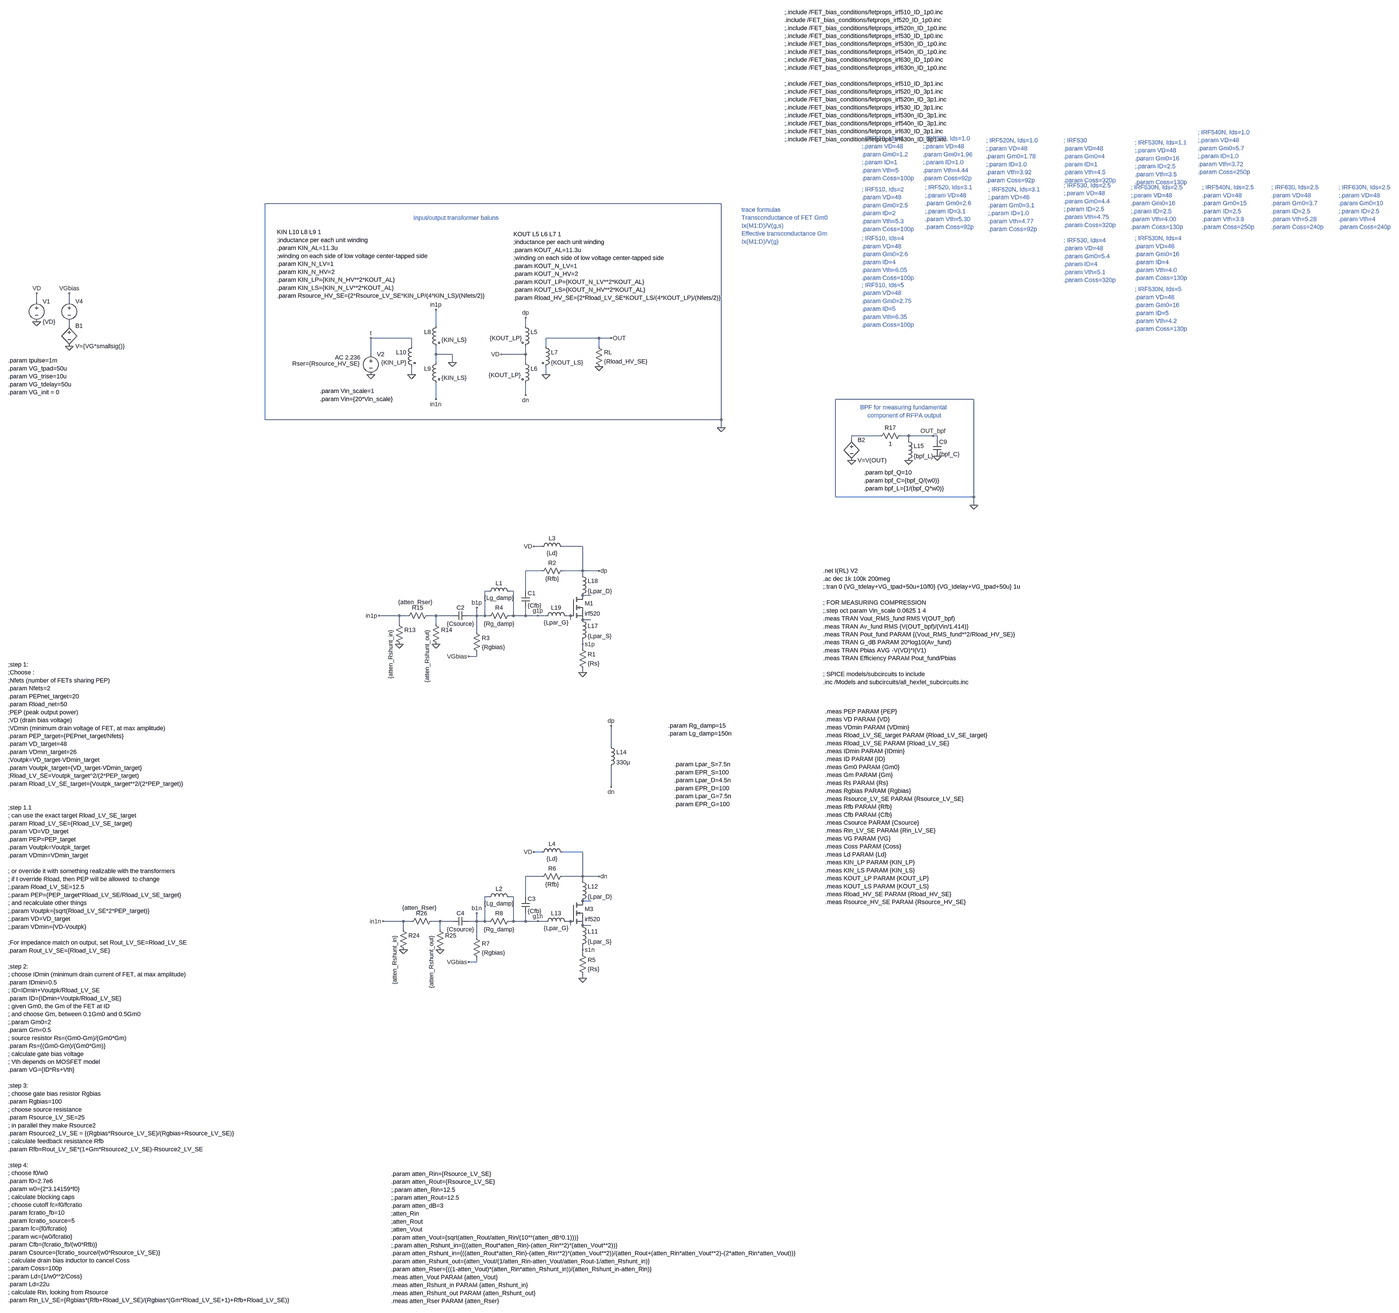
[diagram p0: schematic RFPA_IRF520_pushpull_tran_param.asc, whole sheet]
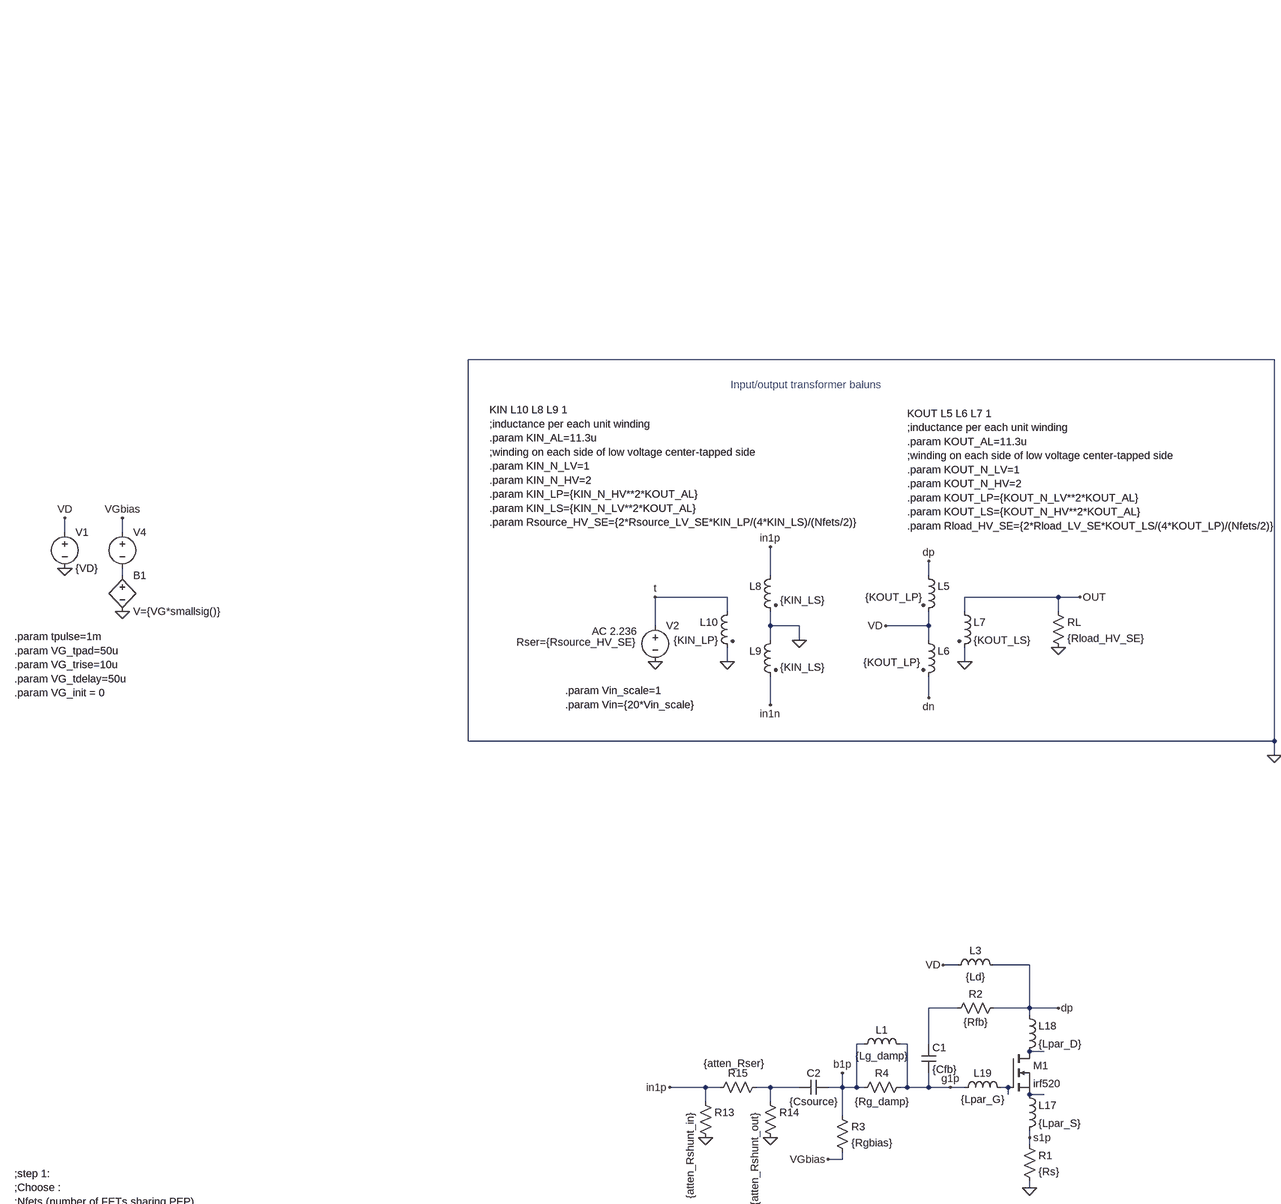
[diagram p1: schematic RFPA_IRF520_pushpull_tran_param.asc, part, row 1 of 2, column 1 of 2]
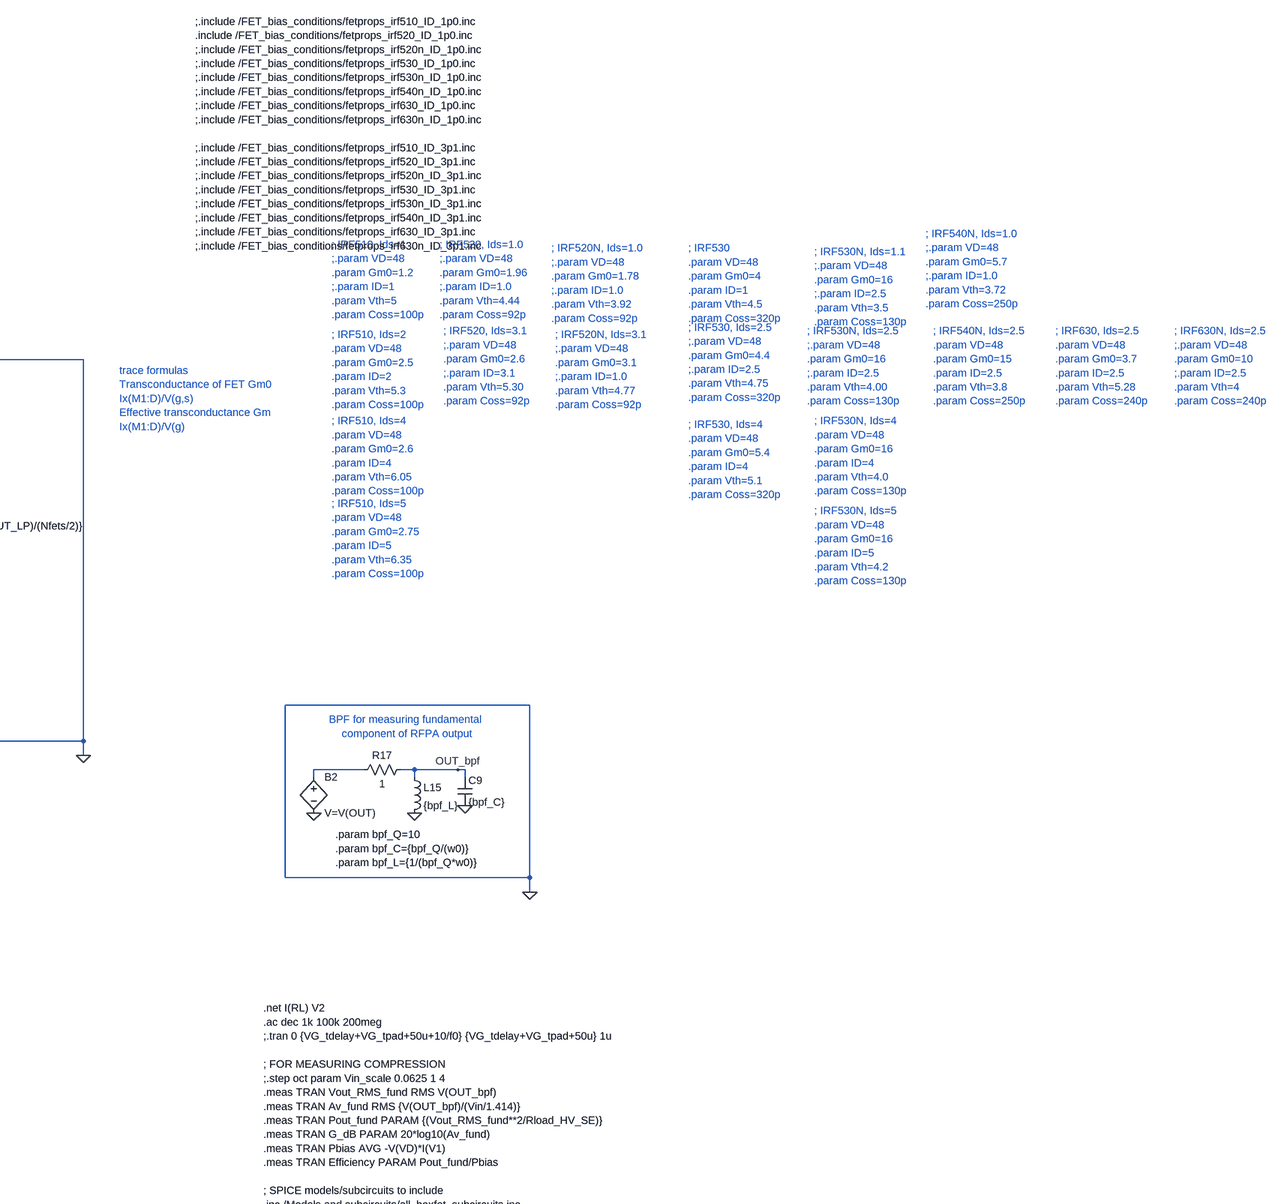
[diagram p2: schematic RFPA_IRF520_pushpull_tran_param.asc, part, row 1 of 2, column 2 of 2]
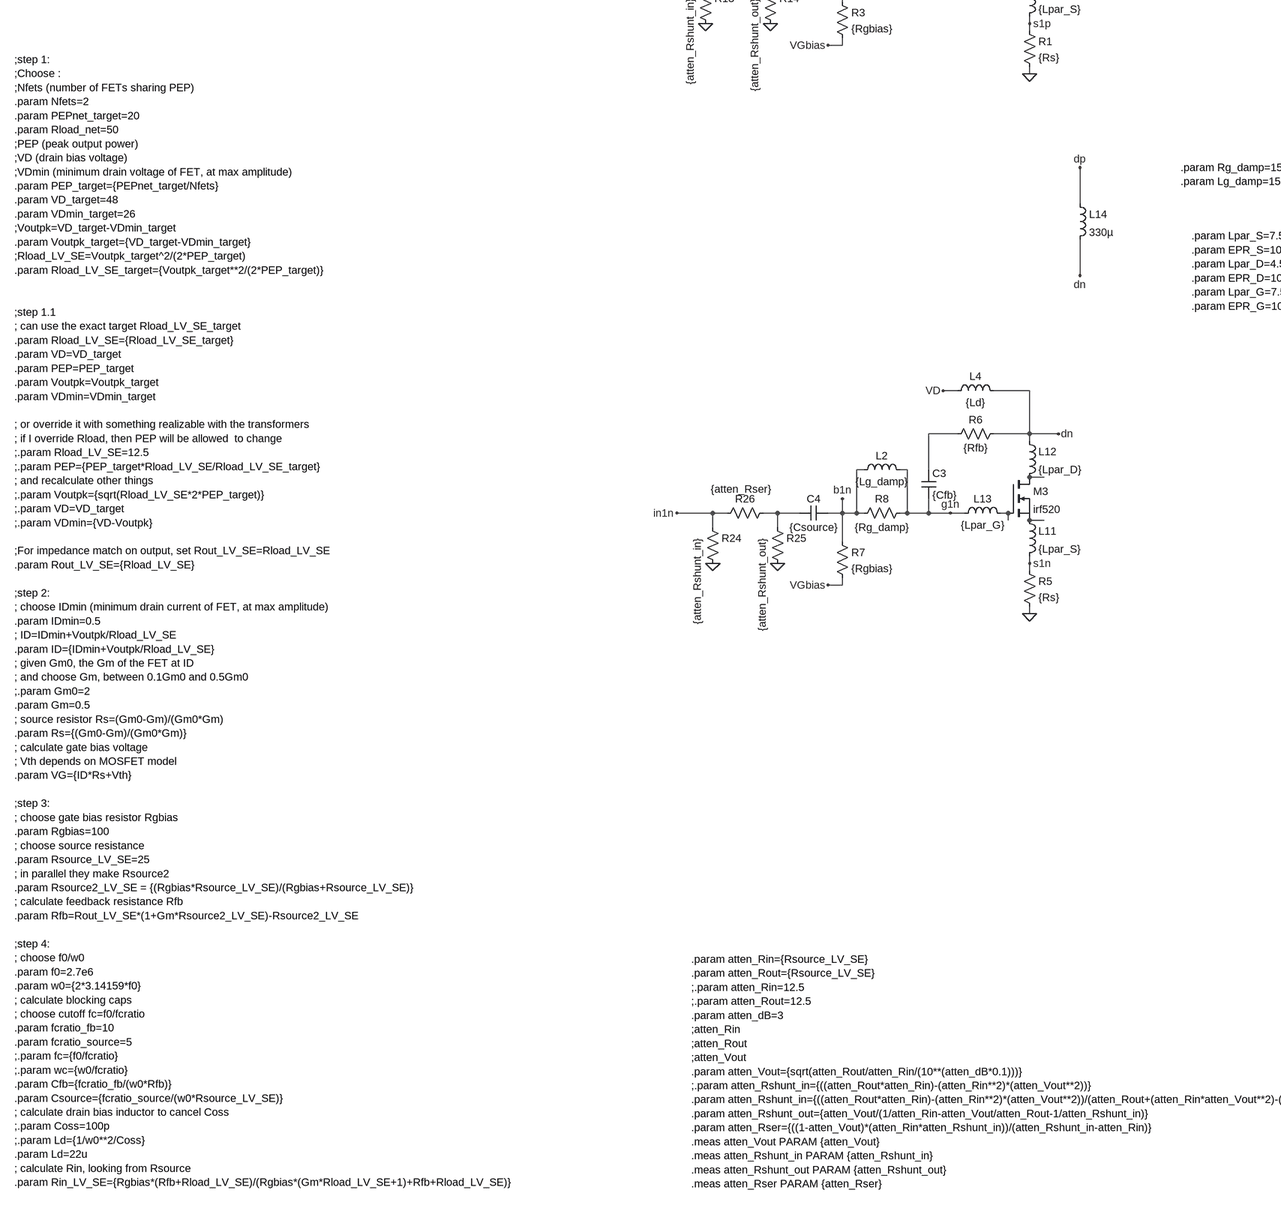
[diagram p3: schematic RFPA_IRF520_pushpull_tran_param.asc, part, row 2 of 2, column 1 of 2]
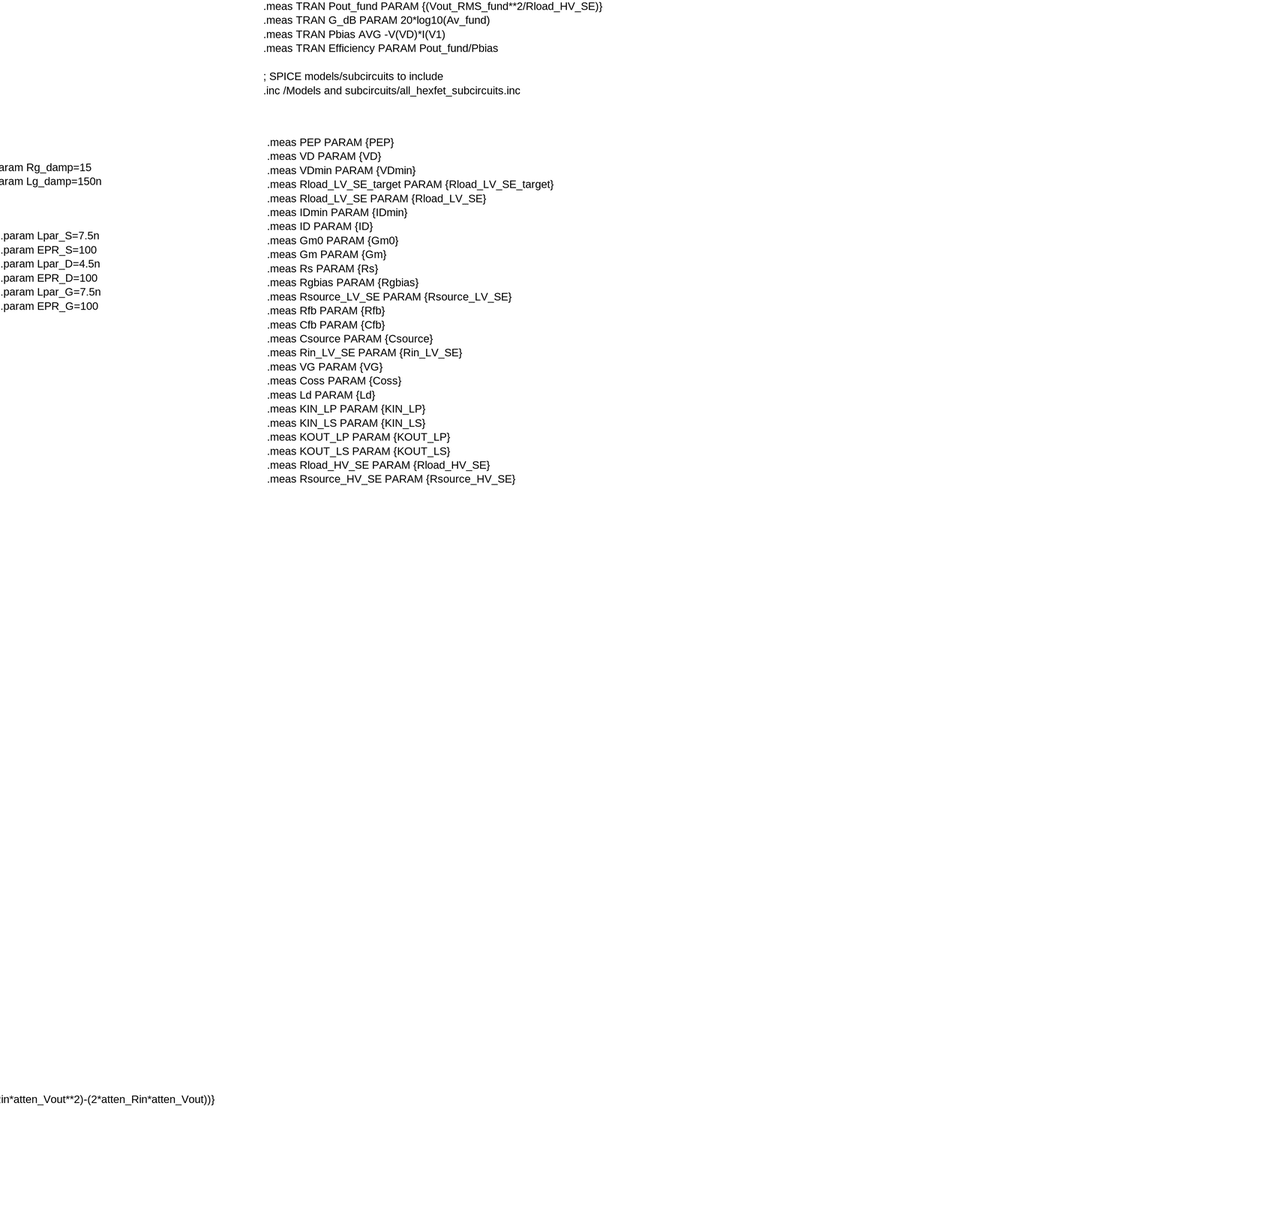
[diagram p4: schematic RFPA_IRF520_pushpull_tran_param.asc, part, row 2 of 2, column 2 of 2]
RFPA_IRF520_pushpull_tran_param.asc, the LTspice schematic file:
Version 4
SHEET 1 5344 3112
WIRE 560 -1712 -1232 -1712
WIRE -2128 -1328 -2128 -1360
WIRE -2000 -1328 -2000 -1360
WIRE -2000 -1232 -2000 -1248
WIRE -560 -1232 -560 -1296
WIRE -208 -1232 -208 -1264
WIRE -656 -1184 -816 -1184
WIRE 80 -1184 -128 -1184
WIRE 128 -1184 80 -1184
WIRE -656 -1152 -656 -1184
WIRE -128 -1152 -128 -1184
WIRE 80 -1152 80 -1184
WIRE -816 -1120 -816 -1184
WIRE -560 -1120 -560 -1152
WIRE -496 -1120 -560 -1120
WIRE -208 -1120 -208 -1152
WIRE -208 -1120 -304 -1120
WIRE -560 -1088 -560 -1120
WIRE -496 -1088 -496 -1120
WIRE -208 -1088 -208 -1120
WIRE -656 -1040 -656 -1072
WIRE -128 -1040 -128 -1072
WIRE -208 -960 -208 -1008
WIRE -560 -944 -560 -1008
WIRE 1552 -944 1008 -944
WIRE -1232 -864 -1232 -1712
WIRE 560 -864 560 -1712
WIRE 560 -864 -1232 -864
WIRE 560 -832 560 -864
WIRE 1184 -800 1072 -800
WIRE 1296 -800 1264 -800
WIRE 1392 -800 1296 -800
WIRE 1408 -800 1392 -800
WIRE 1072 -784 1072 -800
WIRE 1296 -784 1296 -800
WIRE 1408 -784 1408 -800
WIRE 1008 -560 1008 -944
WIRE 1552 -560 1552 -944
WIRE 1552 -560 1008 -560
WIRE 1552 -528 1552 -560
WIRE -144 -336 -176 -336
WIRE 16 -336 -64 -336
WIRE -144 -240 -208 -240
WIRE 16 -240 16 -336
WIRE 16 -240 -64 -240
WIRE 80 -240 16 -240
WIRE 16 -224 16 -240
WIRE -352 -160 -368 -160
WIRE -256 -160 -272 -160
WIRE -208 -160 -208 -240
WIRE 48 -144 16 -144
WIRE -704 -64 -784 -64
WIRE -672 -64 -704 -64
WIRE -560 -64 -592 -64
WIRE -496 -64 -560 -64
WIRE -400 -64 -400 -96
WIRE -400 -64 -432 -64
WIRE -368 -64 -368 -160
WIRE -368 -64 -400 -64
WIRE -352 -64 -368 -64
WIRE -256 -64 -256 -160
WIRE -256 -64 -272 -64
WIRE -208 -64 -208 -96
WIRE -208 -64 -256 -64
WIRE -160 -64 -208 -64
WIRE -128 -64 -160 -64
WIRE -32 -64 -48 -64
WIRE -32 -48 -32 -64
WIRE 48 -48 16 -48
WIRE -704 -32 -704 -64
WIRE -560 -32 -560 -64
WIRE -400 0 -400 -64
WIRE 16 48 16 32
WIRE 16 64 16 48
WIRE -400 96 -400 80
WIRE -400 96 -432 96
WIRE 16 160 16 144
WIRE 128 448 128 368
WIRE 128 608 128 528
WIRE -144 864 -176 864
WIRE 16 864 -64 864
WIRE -144 960 -208 960
WIRE 16 960 16 864
WIRE 16 960 -64 960
WIRE 80 960 16 960
WIRE 16 976 16 960
WIRE -352 1040 -368 1040
WIRE -256 1040 -272 1040
WIRE -208 1040 -208 960
WIRE 48 1056 16 1056
WIRE -688 1136 -768 1136
WIRE -656 1136 -688 1136
WIRE -544 1136 -576 1136
WIRE -496 1136 -544 1136
WIRE -400 1136 -400 1104
WIRE -400 1136 -432 1136
WIRE -368 1136 -368 1040
WIRE -368 1136 -400 1136
WIRE -352 1136 -368 1136
WIRE -256 1136 -256 1040
WIRE -256 1136 -272 1136
WIRE -208 1136 -208 1104
WIRE -208 1136 -256 1136
WIRE -160 1136 -208 1136
WIRE -128 1136 -160 1136
WIRE -32 1136 -48 1136
WIRE -32 1152 -32 1136
WIRE 48 1152 16 1152
WIRE -688 1168 -688 1136
WIRE -544 1168 -544 1136
WIRE -400 1200 -400 1136
WIRE 16 1248 16 1232
WIRE 16 1264 16 1248
WIRE -400 1296 -400 1280
WIRE -400 1296 -432 1296
WIRE 16 1360 16 1344
FLAG 16 160 0
FLAG -816 -1040 0
FLAG -2128 -1248 0
FLAG 80 -240 dp
FLAG -160 -64 g1p
FLAG 16 48 s1p
FLAG -816 -1184 t
FLAG -784 -64 in1p
FLAG -400 -96 b1p
FLAG -176 -336 VD
FLAG -432 96 VGbias
FLAG 80 -1072 0
FLAG -128 -1040 0
FLAG -656 -1040 0
FLAG -496 -1088 0
FLAG -304 -1120 VD
FLAG -2128 -1360 VD
FLAG -2000 -1360 VGbias
FLAG -208 -1264 dp
FLAG -208 -960 dn
FLAG 128 -1184 OUT
FLAG -2000 -1152 0
FLAG 1072 -704 0
FLAG 1296 -704 0
FLAG 1408 -720 0
FLAG 1392 -800 OUT_bpf
FLAG 16 1360 0
FLAG 80 960 dn
FLAG -160 1136 g1n
FLAG 16 1248 s1n
FLAG -400 1104 b1n
FLAG -176 864 VD
FLAG -432 1296 VGbias
FLAG -560 -1296 in1p
FLAG -560 -944 in1n
FLAG -560 48 0
FLAG -704 48 0
FLAG -768 1136 in1n
FLAG -544 1248 0
FLAG -688 1248 0
FLAG 1552 -528 0
FLAG 560 -832 0
FLAG 128 368 dp
FLAG 128 608 dn
SYMBOL res 0 48 R0
SYMATTR InstName R1
SYMATTR Value {Rs}
SYMBOL res -48 -256 R90
WINDOW 0 0 56 VBottom 2
WINDOW 3 32 56 VTop 2
SYMATTR InstName R2
SYMATTR Value {Rfb}
SYMBOL cap -224 -160 R0
SYMATTR InstName C1
SYMATTR Value {Cfb}
SYMBOL res -416 -16 R0
SYMATTR InstName R3
SYMATTR Value {Rgbias}
SYMBOL res -256 -80 R90
WINDOW 0 0 56 VBottom 2
WINDOW 3 32 56 VTop 2
SYMATTR InstName R4
SYMATTR Value {Rg_damp}
SYMBOL ind -368 -144 R270
WINDOW 0 32 56 VTop 2
WINDOW 3 5 56 VBottom 2
SYMATTR InstName L1
SYMATTR Value {Lg_damp}
SYMBOL cap -432 -80 R90
WINDOW 0 0 32 VBottom 2
WINDOW 3 32 32 VTop 2
SYMATTR InstName C2
SYMATTR Value {Csource}
SYMBOL voltage -2128 -1344 R0
WINDOW 123 0 0 Left 0
WINDOW 39 0 0 Left 0
SYMATTR InstName V1
SYMATTR Value {VD}
SYMBOL ind -160 -320 R270
WINDOW 0 32 56 VTop 2
WINDOW 3 5 56 VBottom 2
SYMATTR InstName L3
SYMATTR Value {Ld}
SYMBOL ind2 -224 -1248 R0
WINDOW 3 1 64 Right 2
SYMATTR Value {KOUT_LP}
SYMATTR InstName L5
SYMATTR Type ind
SYMATTR SpiceLine Rser=50m
SYMBOL ind2 -224 -1104 R0
WINDOW 3 -3 65 Right 2
SYMATTR Value {KOUT_LP}
SYMATTR InstName L6
SYMATTR Type ind
SYMATTR SpiceLine Rser=50m
SYMBOL ind2 -144 -1168 R0
SYMATTR InstName L7
SYMATTR Value {KOUT_LS}
SYMATTR Type ind
SYMBOL res 64 -1168 R0
SYMATTR InstName RL
SYMATTR Value {Rload_HV_SE}
SYMBOL ind2 -544 -1248 M0
WINDOW 3 -6 71 Right 2
SYMATTR Value {KIN_LS}
SYMATTR InstName L8
SYMATTR Type ind
SYMBOL ind2 -544 -1104 M0
WINDOW 3 -6 76 Right 2
SYMATTR Value {KIN_LS}
SYMATTR InstName L9
SYMATTR Type ind
SYMBOL ind2 -640 -1168 M0
SYMATTR InstName L10
SYMATTR Value {KIN_LP}
SYMATTR Type ind
SYMBOL voltage -2000 -1344 R0
WINDOW 3 24 96 Invisible 2
WINDOW 123 0 0 Left 0
WINDOW 39 0 0 Left 0
SYMATTR Value PULSE({VG_init} {VG} {VG_tdelay} {VG_trise} {VG_trise} {VG_tpad*2+tpulse-VG_trise} 10m)
SYMATTR InstName V4
SYMBOL voltage -816 -1136 R0
WINDOW 3 -46 82 Invisible 2
WINDOW 123 -40 28 Right 2
WINDOW 39 -45 52 Right 2
SYMATTR Value SINE(0 {Vin} {f0} {VG_tdelay+VG_tpad} 0 0 {tpulse*f0})
SYMATTR Value2 AC 2.236
SYMATTR SpiceLine Rser={Rsource_HV_SE}
SYMATTR InstName V2
SYMBOL bv -2000 -1248 R0
SYMATTR InstName B1
SYMATTR Value V={VG*smallsig()}
SYMBOL bv 1072 -800 R0
SYMATTR InstName B2
SYMATTR Value V=V(OUT)
SYMBOL res 1280 -816 R90
WINDOW 0 0 56 VBottom 2
WINDOW 3 32 56 VTop 2
SYMATTR InstName R17
SYMATTR Value 1
SYMBOL ind 1280 -800 R0
SYMATTR InstName L15
SYMATTR Value {bpf_L}
SYMBOL cap 1392 -784 R0
SYMATTR InstName C9
SYMATTR Value {bpf_C}
SYMBOL nmos -32 -144 R0
SYMATTR InstName M1
SYMATTR Value irf520
SYMATTR Prefix X
SYMBOL ind 0 -64 R0
SYMATTR InstName L17
SYMATTR Value {Lpar_S}
SYMATTR SpiceLine Rpar={EPR_S}
SYMBOL ind 0 -240 R0
SYMATTR InstName L18
SYMATTR Value {Lpar_D}
SYMATTR SpiceLine Rpar={EPR_D}
SYMBOL ind -144 -48 R270
WINDOW 0 32 56 VTop 2
WINDOW 3 5 56 VBottom 2
SYMATTR InstName L19
SYMATTR Value {Lpar_G}
SYMATTR SpiceLine Rpar={EPR_G}
SYMBOL res 0 1248 R0
SYMATTR InstName R5
SYMATTR Value {Rs}
SYMBOL res -48 944 R90
WINDOW 0 0 56 VBottom 2
WINDOW 3 32 56 VTop 2
SYMATTR InstName R6
SYMATTR Value {Rfb}
SYMBOL cap -224 1040 R0
SYMATTR InstName C3
SYMATTR Value {Cfb}
SYMBOL res -416 1184 R0
SYMATTR InstName R7
SYMATTR Value {Rgbias}
SYMBOL res -256 1120 R90
WINDOW 0 0 56 VBottom 2
WINDOW 3 32 56 VTop 2
SYMATTR InstName R8
SYMATTR Value {Rg_damp}
SYMBOL ind -368 1056 R270
WINDOW 0 32 56 VTop 2
WINDOW 3 5 56 VBottom 2
SYMATTR InstName L2
SYMATTR Value {Lg_damp}
SYMBOL cap -432 1120 R90
WINDOW 0 0 32 VBottom 2
WINDOW 3 32 32 VTop 2
SYMATTR InstName C4
SYMATTR Value {Csource}
SYMBOL ind -160 880 R270
WINDOW 0 32 56 VTop 2
WINDOW 3 5 56 VBottom 2
SYMATTR InstName L4
SYMATTR Value {Ld}
SYMBOL nmos -32 1056 R0
SYMATTR InstName M3
SYMATTR Value irf520
SYMATTR Prefix X
SYMBOL ind 0 1136 R0
SYMATTR InstName L11
SYMATTR Value {Lpar_S}
SYMATTR SpiceLine Rpar={EPR_S}
SYMBOL ind 0 960 R0
SYMATTR InstName L12
SYMATTR Value {Lpar_D}
SYMATTR SpiceLine Rpar={EPR_D}
SYMBOL ind -144 1152 R270
WINDOW 0 32 56 VTop 2
WINDOW 3 5 56 VBottom 2
SYMATTR InstName L13
SYMATTR Value {Lpar_G}
SYMATTR SpiceLine Rpar={EPR_G}
SYMBOL res -720 -48 R0
WINDOW 3 -18 39 VRight 2
SYMATTR Value {atten_Rshunt_in}
SYMATTR InstName R13
SYMBOL res -576 -48 R0
WINDOW 3 -18 39 VRight 2
SYMATTR Value {atten_Rshunt_out}
SYMATTR InstName R14
SYMBOL res -576 -80 R90
WINDOW 0 0 56 VBottom 2
WINDOW 3 -53 65 VTop 2
SYMATTR InstName R15
SYMATTR Value {atten_Rser}
SYMBOL res -704 1152 R0
WINDOW 3 -18 39 VRight 2
SYMATTR Value {atten_Rshunt_in}
SYMATTR InstName R24
SYMBOL res -560 1152 R0
WINDOW 3 -18 39 VRight 2
SYMATTR Value {atten_Rshunt_out}
SYMATTR InstName R25
SYMBOL res -560 1120 R90
WINDOW 0 0 56 VBottom 2
WINDOW 3 -53 65 VTop 2
SYMATTR InstName R26
SYMATTR Value {atten_Rser}
SYMBOL ind 112 432 R0
SYMATTR InstName L14
SYMATTR Value 330µ
TEXT 352 368 Left 2 !.param Rg_damp=15\n.param Lg_damp=150n
TEXT 960 -240 Left 2 !.net I(RL) V2\n.ac dec 1k 100k 200meg\n;.tran 0 {VG_tdelay+VG_tpad+50u+10/f0} {VG_tdelay+VG_tpad+50u} 1u\n \n; FOR MEASURING COMPRESSION\n;.step oct param Vin_scale 0.0625 1 4\n.meas TRAN Vout_RMS_fund RMS V(OUT_bpf)\n.meas TRAN Av_fund RMS {V(OUT_bpf)/(Vin/1.414)}\n.meas TRAN Pout_fund PARAM {(Vout_RMS_fund**2/Rload_HV_SE)}\n.meas TRAN G_dB PARAM 20*log10(Av_fund)\n.meas TRAN Pbias AVG -V(VD)*I(V1)\n.meas TRAN Efficiency PARAM Pout_fund/Pbias\n \n; SPICE models/subcircuits to include\n.inc /Models and subcircuits/all_hexfet_subcircuits.inc
TEXT 1904 -1960 Left 2 ;; IRF530\n.param VD=48\n.param Gm0=4\n.param ID=1\n.param Vth=4.5\n.param Coss=320p
TEXT 1112 -1968 Left 2 ;; IRF510, Ids=1\n;.param VD=48\n.param Gm0=1.2\n;.param ID=1\n.param Vth=5\n.param Coss=100p
TEXT 1112 -1768 Left 2 ;; IRF510, Ids=2\n.param VD=48\n.param Gm0=2.5\n.param ID=2\n.param Vth=5.3\n.param Coss=100p
TEXT 1112 -1576 Left 2 ;; IRF510, Ids=4\n.param VD=48\n.param Gm0=2.6\n.param ID=4\n.param Vth=6.05\n.param Coss=100p
TEXT 1112 -1392 Left 2 ;; IRF510, Ids=5\n.param VD=48\n.param Gm0=2.75\n.param ID=5\n.param Vth=6.35\n.param Coss=100p
TEXT 1904 -1784 Left 2 ;; IRF530, Ids=2.5\n;.param VD=48\n.param Gm0=4.4\n;.param ID=2.5\n.param Vth=4.75\n.param Coss=320p
TEXT 1904 -1568 Left 2 ;; IRF530, Ids=4\n.param VD=48\n.param Gm0=5.4\n.param ID=4\n.param Vth=5.1\n.param Coss=320p
TEXT 2184 -1576 Left 2 ;; IRF530N, Ids=4\n.param VD=48\n.param Gm0=16\n.param ID=4\n.param Vth=4.0\n.param Coss=130p
TEXT 2184 -1376 Left 2 ;; IRF530N, Ids=5\n.param VD=48\n.param Gm0=16\n.param ID=5\n.param Vth=4.2\n.param Coss=130p
TEXT 2168 -1776 Left 2 ;; IRF530N, Ids=2.5\n;.param VD=48\n.param Gm0=16\n;.param ID=2.5\n.param Vth=4.00\n.param Coss=130p
TEXT 2448 -1776 Left 2 ;; IRF540N, Ids=2.5\n.param VD=48\n.param Gm0=15\n.param ID=2.5\n.param Vth=3.8\n.param Coss=250p
TEXT 2720 -1776 Left 2 ;; IRF630, Ids=2.5\n.param VD=48\n.param Gm0=3.7\n.param ID=2.5\n.param Vth=5.28\n.param Coss=240p
TEXT 640 -1688 Left 2 ;trace formulas\nTransconductance of FET Gm0\nIx(M1:D)/V(g,s)\nEffective transconductance Gm\nIx(M1:D)/V(g)
TEXT 2984 -1776 Left 2 ;; IRF630N, Ids=2.5\n;.param VD=48\n.param Gm0=10\n;.param ID=2.5\n.param Vth=4\n.param Coss=240p
TEXT -2240 128 Left 2 !;step 1:\n;Choose :\n;Nfets (number of FETs sharing PEP)\n.param Nfets=2\n.param PEPnet_target=20\n.param Rload_net=50\n;PEP (peak output power) \n;VD (drain bias voltage)\n;VDmin (minimum drain voltage of FET, at max amplitude)\n.param PEP_target={PEPnet_target/Nfets}\n.param VD_target=48\n.param VDmin_target=26\n;Voutpk=VD_target-VDmin_target\n.param Voutpk_target={VD_target-VDmin_target}\n;Rload_LV_SE=Voutpk_target^2/(2*PEP_target)\n.param Rload_LV_SE_target={Voutpk_target**2/(2*PEP_target)}\n \n \n;step 1.1 \n; can use the exact target Rload_LV_SE_target\n.param Rload_LV_SE={Rload_LV_SE_target}\n.param VD=VD_target\n.param PEP=PEP_target\n.param Voutpk=Voutpk_target\n.param VDmin=VDmin_target\n \n; or override it with something realizable with the transformers\n; if I override Rload, then PEP will be allowed  to change\n;.param Rload_LV_SE=12.5\n;.param PEP={PEP_target*Rload_LV_SE/Rload_LV_SE_target}\n; and recalculate other things\n;.param Voutpk={sqrt(Rload_LV_SE*2*PEP_target)}\n;.param VD=VD_target\n;.param VDmin={VD-Voutpk}\n \n;For impedance match on output, set Rout_LV_SE=Rload_LV_SE\n.param Rout_LV_SE={Rload_LV_SE}\n \n;step 2:\n; choose IDmin (minimum drain current of FET, at max amplitude)\n.param IDmin=0.5\n; ID=IDmin+Voutpk/Rload_LV_SE\n.param ID={IDmin+Voutpk/Rload_LV_SE}\n; given Gm0, the Gm of the FET at ID\n; and choose Gm, between 0.1Gm0 and 0.5Gm0\n;.param Gm0=2\n.param Gm=0.5\n; source resistor Rs=(Gm0-Gm)/(Gm0*Gm)\n.param Rs={(Gm0-Gm)/(Gm0*Gm)}\n; calculate gate bias voltage\n; Vth depends on MOSFET model\n.param VG={ID*Rs+Vth}\n \n;step 3:\n; choose gate bias resistor Rgbias\n.param Rgbias=100\n; choose source resistance\n.param Rsource_LV_SE=25\n; in parallel they make Rsource2\n.param Rsource2_LV_SE = {(Rgbias*Rsource_LV_SE)/(Rgbias+Rsource_LV_SE)}\n; calculate feedback resistance Rfb\n.param Rfb=Rout_LV_SE*(1+Gm*Rsource2_LV_SE)-Rsource2_LV_SE\n \n;step 4:\n; choose f0/w0\n.param f0=2.7e6\n.param w0={2*3.14159*f0}\n; calculate blocking caps\n; choose cutoff fc=f0/fcratio\n.param fcratio_fb=10\n.param fcratio_source=5\n;.param fc={f0/fcratio}\n;.param wc={w0/fcratio}\n.param Cfb={fcratio_fb/(w0*Rfb)}\n.param Csource={fcratio_source/(w0*Rsource_LV_SE)}\n; calculate drain bias inductor to cancel Coss\n;.param Coss=100p\n;.param Ld={1/w0**2/Coss}\n.param Ld=22u \n; calculate Rin, looking from Rsource\n.param Rin_LV_SE={Rgbias*(Rfb+Rload_LV_SE)/(Rgbias*(Gm*Rload_LV_SE+1)+Rfb+Rload_LV_SE)}
TEXT 968 312 Left 2 !.meas PEP PARAM {PEP}\n.meas VD PARAM {VD}\n.meas VDmin PARAM {VDmin}\n.meas Rload_LV_SE_target PARAM {Rload_LV_SE_target}\n.meas Rload_LV_SE PARAM {Rload_LV_SE}\n.meas IDmin PARAM {IDmin}\n.meas ID PARAM {ID}\n.meas Gm0 PARAM {Gm0}\n.meas Gm PARAM {Gm}\n.meas Rs PARAM {Rs}\n.meas Rgbias PARAM {Rgbias}\n.meas Rsource_LV_SE PARAM {Rsource_LV_SE}\n.meas Rfb PARAM {Rfb}\n.meas Cfb PARAM {Cfb}\n.meas Csource PARAM {Csource}\n.meas Rin_LV_SE PARAM {Rin_LV_SE}\n.meas VG PARAM {VG}\n.meas Coss PARAM {Coss}\n.meas Ld PARAM {Ld}\n.meas KIN_LP PARAM {KIN_LP}\n.meas KIN_LS PARAM {KIN_LS}\n.meas KOUT_LP PARAM {KOUT_LP}\n.meas KOUT_LS PARAM {KOUT_LS}\n.meas Rload_HV_SE PARAM {Rload_HV_SE}\n.meas Rsource_HV_SE PARAM {Rsource_HV_SE}
TEXT -256 -1592 Left 2 !KOUT L5 L6 L7 1\n;inductance per each unit winding\n.param KOUT_AL=11.3u\n;winding on each side of low voltage center-tapped side\n.param KOUT_N_LV=1\n.param KOUT_N_HV=2\n.param KOUT_LP={KOUT_N_LV**2*KOUT_AL}\n.param KOUT_LS={KOUT_N_HV**2*KOUT_AL}\n.param Rload_HV_SE={2*Rload_LV_SE*KOUT_LS/(4*KOUT_LP)/(Nfets/2)}
TEXT -1184 -1600 Left 2 !KIN L10 L8 L9 1\n;inductance per each unit winding\n.param KIN_AL=11.3u\n;winding on each side of low voltage center-tapped side\n.param KIN_N_LV=1\n.param KIN_N_HV=2\n.param KIN_LP={KIN_N_HV**2*KOUT_AL}\n.param KIN_LS={KIN_N_LV**2*KOUT_AL}\n.param Rsource_HV_SE={2*Rsource_LV_SE*KIN_LP/(4*KIN_LS)/(Nfets/2)}
TEXT -2240 -1096 Left 2 !.param tpulse=1m\n.param VG_tpad=50u\n.param VG_trise=10u\n.param VG_tdelay=50u\n.param VG_init = 0
TEXT -1016 -976 Left 2 !.param Vin_scale=1\n.param Vin={20*Vin_scale}
TEXT 1120 -656 Left 2 !.param bpf_Q=10\n.param bpf_C={bpf_Q/(w0)}\n.param bpf_L={1/(bpf_Q*w0)}
TEXT 376 520 Left 2 !.param Lpar_S=7.5n\n.param EPR_S=100\n.param Lpar_D=4.5n\n.param EPR_D=100\n.param Lpar_G=7.5n\n.param EPR_G=100
TEXT -736 2128 Left 2 !.param atten_Rin={Rsource_LV_SE}\n.param atten_Rout={Rsource_LV_SE}\n;.param atten_Rin=12.5\n;.param atten_Rout=12.5\n.param atten_dB=3\n;atten_Rin\n;atten_Rout\n;atten_Vout\n.param atten_Vout={sqrt(atten_Rout/atten_Rin/(10**(atten_dB*0.1)))}\n;.param atten_Rshunt_in={((atten_Rout*atten_Rin)-(atten_Rin**2)*(atten_Vout**2))}\n.param atten_Rshunt_in={((atten_Rout*atten_Rin)-(atten_Rin**2)*(atten_Vout**2))/(atten_Rout+(atten_Rin*atten_Vout**2)-(2*atten_Rin*atten_Vout))}\n.param atten_Rshunt_out={atten_Vout/(1/atten_Rin-atten_Vout/atten_Rout-1/atten_Rshunt_in)}\n.param atten_Rser={((1-atten_Vout)*(atten_Rin*atten_Rshunt_in))/(atten_Rshunt_in-atten_Rin)}\n.meas atten_Vout PARAM {atten_Vout}\n.meas atten_Rshunt_in PARAM {atten_Rshunt_in}\n.meas atten_Rshunt_out PARAM {atten_Rshunt_out}\n.meas atten_Rser PARAM {atten_Rser}
TEXT 1280 -896 Center 2 ;BPF for measuring fundamental \ncomponent of RFPA output
TEXT -648 -1656 Left 2 ;Input/output transformer baluns
TEXT 2184 -1952 Left 2 ;; IRF530N, Ids=1.1\n;.param VD=48\n.param Gm0=16\n;.param ID=2.5\n.param Vth=3.5\n.param Coss=130p
TEXT 2432 -1992 Left 2 ;; IRF540N, Ids=1.0\n;.param VD=48\n.param Gm0=5.7\n;.param ID=1.0\n.param Vth=3.72\n.param Coss=250p
TEXT 1600 -1960 Left 2 ;; IRF520N, Ids=1.0\n;.param VD=48\n.param Gm0=1.78\n;.param ID=1.0\n.param Vth=3.92\n.param Coss=92p
TEXT 1608 -1768 Left 2 ;; IRF520N, Ids=3.1\n;.param VD=48\n.param Gm0=3.1\n;.param ID=1.0\n.param Vth=4.77\n.param Coss=92p
TEXT 1352 -1968 Left 2 ;; IRF520, Ids=1.0\n;.param VD=48\n.param Gm0=1.96\n;.param ID=1.0\n.param Vth=4.44\n.param Coss=92p
TEXT 1360 -1776 Left 2 ;; IRF520, Ids=3.1\n;.param VD=48\n.param Gm0=2.6\n;.param ID=3.1\n.param Vth=5.30\n.param Coss=92p
TEXT 808 -2464 Left 2 !;.include /FET_bias_conditions/fetprops_irf510_ID_1p0.inc\n.include /FET_bias_conditions/fetprops_irf520_ID_1p0.inc\n;.include /FET_bias_conditions/fetprops_irf520n_ID_1p0.inc\n;.include /FET_bias_conditions/fetprops_irf530_ID_1p0.inc\n;.include /FET_bias_conditions/fetprops_irf530n_ID_1p0.inc\n;.include /FET_bias_conditions/fetprops_irf540n_ID_1p0.inc\n;.include /FET_bias_conditions/fetprops_irf630_ID_1p0.inc\n;.include /FET_bias_conditions/fetprops_irf630n_ID_1p0.inc\n \n;.include /FET_bias_conditions/fetprops_irf510_ID_3p1.inc\n;.include /FET_bias_conditions/fetprops_irf520_ID_3p1.inc\n;.include /FET_bias_conditions/fetprops_irf520n_ID_3p1.inc\n;.include /FET_bias_conditions/fetprops_irf530_ID_3p1.inc\n;.include /FET_bias_conditions/fetprops_irf530n_ID_3p1.inc\n;.include /FET_bias_conditions/fetprops_irf540n_ID_3p1.inc\n;.include /FET_bias_conditions/fetprops_irf630_ID_3p1.inc\n;.include /FET_bias_conditions/fetprops_irf630n_ID_3p1.inc

The netlist it stands for:
* RFPA_IRF520_pushpull_tran_param.asc
R1 s1p 0 {Rs}
R2 dp N003 {Rfb}
C1 N003 g1p {Cfb}
R3 b1p VGbias {Rgbias}
R4 g1p b1p {Rg_damp}
L1 b1p g1p {Lg_damp}
C2 b1p N005 {Csource}
V1 VD 0 {VD}
L3 VD dp {Ld}
L5 dp VD {KOUT_LP} Rser=50m
L6 VD dn {KOUT_LP} Rser=50m
L7 OUT 0 {KOUT_LS}
RL OUT 0 {Rload_HV_SE}
L8 in1p 0 {KIN_LS}
L9 0 in1n {KIN_LS}
L10 t 0 {KIN_LP}
V4 VGbias N001 PULSE({VG_init} {VG} {VG_tdelay} {VG_trise} {VG_trise} {VG_tpad*2+tpulse-VG_trise} 10m)
V2 t 0 SINE(0 {Vin} {f0} {VG_tdelay+VG_tpad} 0 0 {tpulse*f0}) AC 2.236 Rser={Rsource_HV_SE}
B1 N001 0 V={VG*smallsig()}
B2 N002 0 V=V(OUT)
R17 OUT_bpf N002 1
L15 OUT_bpf 0 {bpf_L}
C9 OUT_bpf 0 {bpf_C}
XM1 N004 N006 N007 irf520  ; pins D G S
L17 N007 s1p {Lpar_S} Rpar={EPR_S}
L18 dp N004 {Lpar_D} Rpar={EPR_D}
L19 g1p N006 {Lpar_G} Rpar={EPR_G}
R5 s1n 0 {Rs}
R6 dn N008 {Rfb}
C3 N008 g1n {Cfb}
R7 b1n VGbias {Rgbias}
R8 g1n b1n {Rg_damp}
L2 b1n g1n {Lg_damp}
C4 b1n N010 {Csource}
L4 VD dn {Ld}
XM3 N009 N011 N012 irf520  ; pins D G S
L11 N012 s1n {Lpar_S} Rpar={EPR_S}
L12 dn N009 {Lpar_D} Rpar={EPR_D}
L13 g1n N011 {Lpar_G} Rpar={EPR_G}
R13 in1p 0 {atten_Rshunt_in}
R14 N005 0 {atten_Rshunt_out}
R15 N005 in1p {atten_Rser}
R24 in1n 0 {atten_Rshunt_in}
R25 N010 0 {atten_Rshunt_out}
R26 N010 in1n {atten_Rser}
L14 dp dn 330µ
.param Rg_damp=15
.param Lg_damp=150n
.net I(RL) V2
.ac dec 1k 100k 200meg
;.tran 0 {VG_tdelay+VG_tpad+50u+10/f0} {VG_tdelay+VG_tpad+50u} 1u
; FOR MEASURING COMPRESSION
;.step oct param Vin_scale 0.0625 1 4
.meas TRAN Vout_RMS_fund RMS V(OUT_bpf)
.meas TRAN Av_fund RMS {V(OUT_bpf)/(Vin/1.414)}
.meas TRAN Pout_fund PARAM {(Vout_RMS_fund**2/Rload_HV_SE)}
.meas TRAN G_dB PARAM 20*log10(Av_fund)
.meas TRAN Pbias AVG -V(VD)*I(V1)
.meas TRAN Efficiency PARAM Pout_fund/Pbias
; SPICE models/subcircuits to include
.inc /Models and subcircuits/all_hexfet_subcircuits.inc
* ; IRF530
* .param VD=48
* .param Gm0=4
* .param ID=1
* .param Vth=4.5
* .param Coss=320p
* ; IRF510, Ids=1
* ;.param VD=48
* .param Gm0=1.2
* ;.param ID=1
* .param Vth=5
* .param Coss=100p
* ; IRF510, Ids=2
* .param VD=48
* .param Gm0=2.5
* .param ID=2
* .param Vth=5.3
* .param Coss=100p
* ; IRF510, Ids=4
* .param VD=48
* .param Gm0=2.6
* .param ID=4
* .param Vth=6.05
* .param Coss=100p
* ; IRF510, Ids=5
* .param VD=48
* .param Gm0=2.75
* .param ID=5
* .param Vth=6.35
* .param Coss=100p
* ; IRF530, Ids=2.5
* ;.param VD=48
* .param Gm0=4.4
* ;.param ID=2.5
* .param Vth=4.75
* .param Coss=320p
* ; IRF530, Ids=4
* .param VD=48
* .param Gm0=5.4
* .param ID=4
* .param Vth=5.1
* .param Coss=320p
* ; IRF530N, Ids=4
* .param VD=48
* .param Gm0=16
* .param ID=4
* .param Vth=4.0
* .param Coss=130p
* ; IRF530N, Ids=5
* .param VD=48
* .param Gm0=16
* .param ID=5
* .param Vth=4.2
* .param Coss=130p
* ; IRF530N, Ids=2.5
* ;.param VD=48
* .param Gm0=16
* ;.param ID=2.5
* .param Vth=4.00
* .param Coss=130p
* ; IRF540N, Ids=2.5
* .param VD=48
* .param Gm0=15
* .param ID=2.5
* .param Vth=3.8
* .param Coss=250p
* ; IRF630, Ids=2.5
* .param VD=48
* .param Gm0=3.7
* .param ID=2.5
* .param Vth=5.28
* .param Coss=240p
* trace formulas
* Transconductance of FET Gm0
* Ix(M1:D)/V(g,s)
* Effective transconductance Gm
* Ix(M1:D)/V(g)
* ; IRF630N, Ids=2.5
* ;.param VD=48
* .param Gm0=10
* ;.param ID=2.5
* .param Vth=4
* .param Coss=240p
;step 1:
;Choose :
;Nfets (number of FETs sharing PEP)
.param Nfets=2
.param PEPnet_target=20
.param Rload_net=50
;PEP (peak output power)
;VD (drain bias voltage)
;VDmin (minimum drain voltage of FET, at max amplitude)
.param PEP_target={PEPnet_target/Nfets}
.param VD_target=48
.param VDmin_target=26
;Voutpk=VD_target-VDmin_target
.param Voutpk_target={VD_target-VDmin_target}
;Rload_LV_SE=Voutpk_target^2/(2*PEP_target)
.param Rload_LV_SE_target={Voutpk_target**2/(2*PEP_target)}
;step 1.1
; can use the exact target Rload_LV_SE_target
.param Rload_LV_SE={Rload_LV_SE_target}
.param VD=VD_target
.param PEP=PEP_target
.param Voutpk=Voutpk_target
.param VDmin=VDmin_target
; or override it with something realizable with the transformers
; if I override Rload, then PEP will be allowed  to change
;.param Rload_LV_SE=12.5
;.param PEP={PEP_target*Rload_LV_SE/Rload_LV_SE_target}
; and recalculate other things
;.param Voutpk={sqrt(Rload_LV_SE*2*PEP_target)}
;.param VD=VD_target
;.param VDmin={VD-Voutpk}
;For impedance match on output, set Rout_LV_SE=Rload_LV_SE
.param Rout_LV_SE={Rload_LV_SE}
;step 2:
; choose IDmin (minimum drain current of FET, at max amplitude)
.param IDmin=0.5
; ID=IDmin+Voutpk/Rload_LV_SE
.param ID={IDmin+Voutpk/Rload_LV_SE}
; given Gm0, the Gm of the FET at ID
; and choose Gm, between 0.1Gm0 and 0.5Gm0
;.param Gm0=2
.param Gm=0.5
; source resistor Rs=(Gm0-Gm)/(Gm0*Gm)
.param Rs={(Gm0-Gm)/(Gm0*Gm)}
; calculate gate bias voltage
; Vth depends on MOSFET model
.param VG={ID*Rs+Vth}
;step 3:
; choose gate bias resistor Rgbias
.param Rgbias=100
; choose source resistance
.param Rsource_LV_SE=25
; in parallel they make Rsource2
.param Rsource2_LV_SE = {(Rgbias*Rsource_LV_SE)/(Rgbias+Rsource_LV_SE)}
; calculate feedback resistance Rfb
.param Rfb=Rout_LV_SE*(1+Gm*Rsource2_LV_SE)-Rsource2_LV_SE
;step 4:
; choose f0/w0
.param f0=2.7e6
.param w0={2*3.14159*f0}
; calculate blocking caps
; choose cutoff fc=f0/fcratio
.param fcratio_fb=10
.param fcratio_source=5
;.param fc={f0/fcratio}
;.param wc={w0/fcratio}
.param Cfb={fcratio_fb/(w0*Rfb)}
.param Csource={fcratio_source/(w0*Rsource_LV_SE)}
; calculate drain bias inductor to cancel Coss
;.param Coss=100p
;.param Ld={1/w0**2/Coss}
.param Ld=22u
; calculate Rin, looking from Rsource
.param Rin_LV_SE={Rgbias*(Rfb+Rload_LV_SE)/(Rgbias*(Gm*Rload_LV_SE+1)+Rfb+Rload_LV_SE)}
.meas PEP PARAM {PEP}
.meas VD PARAM {VD}
.meas VDmin PARAM {VDmin}
.meas Rload_LV_SE_target PARAM {Rload_LV_SE_target}
.meas Rload_LV_SE PARAM {Rload_LV_SE}
.meas IDmin PARAM {IDmin}
.meas ID PARAM {ID}
.meas Gm0 PARAM {Gm0}
.meas Gm PARAM {Gm}
.meas Rs PARAM {Rs}
.meas Rgbias PARAM {Rgbias}
.meas Rsource_LV_SE PARAM {Rsource_LV_SE}
.meas Rfb PARAM {Rfb}
.meas Cfb PARAM {Cfb}
.meas Csource PARAM {Csource}
.meas Rin_LV_SE PARAM {Rin_LV_SE}
.meas VG PARAM {VG}
.meas Coss PARAM {Coss}
.meas Ld PARAM {Ld}
.meas KIN_LP PARAM {KIN_LP}
.meas KIN_LS PARAM {KIN_LS}
.meas KOUT_LP PARAM {KOUT_LP}
.meas KOUT_LS PARAM {KOUT_LS}
.meas Rload_HV_SE PARAM {Rload_HV_SE}
.meas Rsource_HV_SE PARAM {Rsource_HV_SE}
KOUT L5 L6 L7 1
;inductance per each unit winding
.param KOUT_AL=11.3u
;winding on each side of low voltage center-tapped side
.param KOUT_N_LV=1
.param KOUT_N_HV=2
.param KOUT_LP={KOUT_N_LV**2*KOUT_AL}
.param KOUT_LS={KOUT_N_HV**2*KOUT_AL}
.param Rload_HV_SE={2*Rload_LV_SE*KOUT_LS/(4*KOUT_LP)/(Nfets/2)}
KIN L10 L8 L9 1
;inductance per each unit winding
.param KIN_AL=11.3u
;winding on each side of low voltage center-tapped side
.param KIN_N_LV=1
.param KIN_N_HV=2
.param KIN_LP={KIN_N_HV**2*KOUT_AL}
.param KIN_LS={KIN_N_LV**2*KOUT_AL}
.param Rsource_HV_SE={2*Rsource_LV_SE*KIN_LP/(4*KIN_LS)/(Nfets/2)}
.param tpulse=1m
.param VG_tpad=50u
.param VG_trise=10u
.param VG_tdelay=50u
.param VG_init = 0
.param Vin_scale=1
.param Vin={20*Vin_scale}
.param bpf_Q=10
.param bpf_C={bpf_Q/(w0)}
.param bpf_L={1/(bpf_Q*w0)}
.param Lpar_S=7.5n
.param EPR_S=100
.param Lpar_D=4.5n
.param EPR_D=100
.param Lpar_G=7.5n
.param EPR_G=100
.param atten_Rin={Rsource_LV_SE}
.param atten_Rout={Rsource_LV_SE}
;.param atten_Rin=12.5
;.param atten_Rout=12.5
.param atten_dB=3
;atten_Rin
;atten_Rout
;atten_Vout
.param atten_Vout={sqrt(atten_Rout/atten_Rin/(10**(atten_dB*0.1)))}
;.param atten_Rshunt_in={((atten_Rout*atten_Rin)-(atten_Rin**2)*(atten_Vout**2))}
.param atten_Rshunt_in={((atten_Rout*atten_Rin)-(atten_Rin**2)*(atten_Vout**2))/(atten_Rout+(atten_Rin*atten_Vout**2)-(2*atten_Rin*atten_Vout))}
.param atten_Rshunt_out={atten_Vout/(1/atten_Rin-atten_Vout/atten_Rout-1/atten_Rshunt_in)}
.param atten_Rser={((1-atten_Vout)*(atten_Rin*atten_Rshunt_in))/(atten_Rshunt_in-atten_Rin)}
.meas atten_Vout PARAM {atten_Vout}
.meas atten_Rshunt_in PARAM {atten_Rshunt_in}
.meas atten_Rshunt_out PARAM {atten_Rshunt_out}
.meas atten_Rser PARAM {atten_Rser}
* BPF for measuring fundamental
* component of RFPA output
* Input/output transformer baluns
* ; IRF530N, Ids=1.1
* ;.param VD=48
* .param Gm0=16
* ;.param ID=2.5
* .param Vth=3.5
* .param Coss=130p
* ; IRF540N, Ids=1.0
* ;.param VD=48
* .param Gm0=5.7
* ;.param ID=1.0
* .param Vth=3.72
* .param Coss=250p
* ; IRF520N, Ids=1.0
* ;.param VD=48
* .param Gm0=1.78
* ;.param ID=1.0
* .param Vth=3.92
* .param Coss=92p
* ; IRF520N, Ids=3.1
* ;.param VD=48
* .param Gm0=3.1
* ;.param ID=1.0
* .param Vth=4.77
* .param Coss=92p
* ; IRF520, Ids=1.0
* ;.param VD=48
* .param Gm0=1.96
* ;.param ID=1.0
* .param Vth=4.44
* .param Coss=92p
* ; IRF520, Ids=3.1
* ;.param VD=48
* .param Gm0=2.6
* ;.param ID=3.1
* .param Vth=5.30
* .param Coss=92p
;.include /FET_bias_conditions/fetprops_irf510_ID_1p0.inc
.include /FET_bias_conditions/fetprops_irf520_ID_1p0.inc
;.include /FET_bias_conditions/fetprops_irf520n_ID_1p0.inc
;.include /FET_bias_conditions/fetprops_irf530_ID_1p0.inc
;.include /FET_bias_conditions/fetprops_irf530n_ID_1p0.inc
;.include /FET_bias_conditions/fetprops_irf540n_ID_1p0.inc
;.include /FET_bias_conditions/fetprops_irf630_ID_1p0.inc
;.include /FET_bias_conditions/fetprops_irf630n_ID_1p0.inc
;.include /FET_bias_conditions/fetprops_irf510_ID_3p1.inc
;.include /FET_bias_conditions/fetprops_irf520_ID_3p1.inc
;.include /FET_bias_conditions/fetprops_irf520n_ID_3p1.inc
;.include /FET_bias_conditions/fetprops_irf530_ID_3p1.inc
;.include /FET_bias_conditions/fetprops_irf530n_ID_3p1.inc
;.include /FET_bias_conditions/fetprops_irf540n_ID_3p1.inc
;.include /FET_bias_conditions/fetprops_irf630_ID_3p1.inc
;.include /FET_bias_conditions/fetprops_irf630n_ID_3p1.inc
.backanno
.end